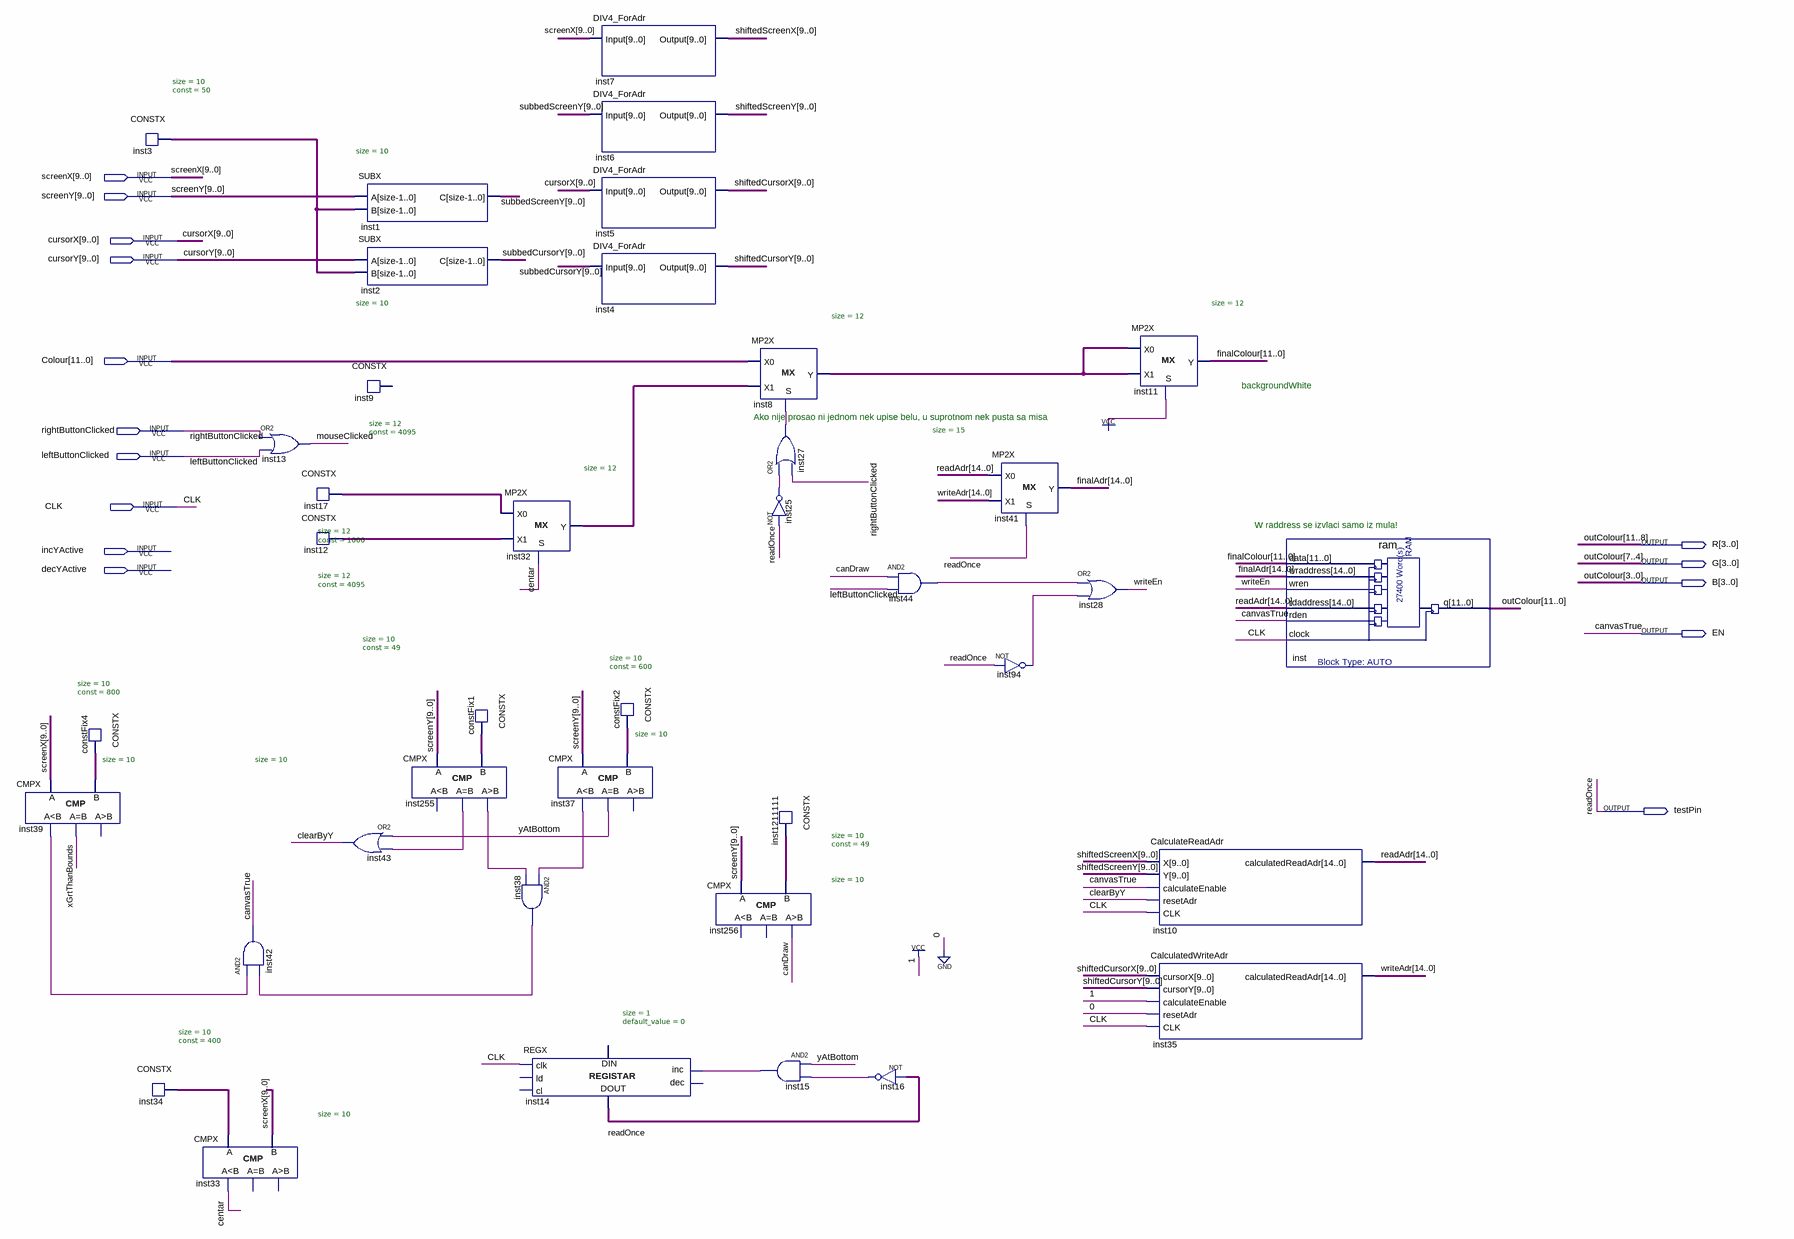
[diagram p0: schematic sheet]
// Quartus schematic Canvas.bdf as structural Verilog: 39 symbols, 15 pins
module Canvas (
  input  [9:0] screenX,
  input  [9:0] screenY,
  input  [9:0] cursorX,
  input  [9:0] cursorY,
  input  [11:0] Colour,
  input  rightButtonClicked,
  input  leftButtonClicked,
  input  CLK,
  input  incYActive,
  input  decYActive,
  output [3:0] R,
  output [3:0] G,
  output [3:0] B,
  output EN,
  output testPin
);

  wire canDraw, centar, clearByY, inst15_out, inst16_out, inst25_out, inst27_out, inst37_ls, inst38_out,
       inst39_ls, inst44_out, inst94_out, inst255_eq, inst255_gr, mouseClicked, writeEn, xGrtThanBounds,
       yAtBottom;
  wire [9:0] constFix1_data, constFix2_data, constFix4_data, inst3_data, inst34_data, inst1211111_data,
       shiftedCursorX, shiftedCursorY, shiftedScreenX, shiftedScreenY, subbedCursorY, subbedScreenY;
  wire [11:0] finalColour, inst8_y, inst12_data, inst17_data, inst32_y;
  wire [14:0] finalAdr, readAdr, writeAdr;

  CMPX #(.size(10)) inst39 (.A(screenX), .B(constFix4_data), .ls(inst39_ls), .eq(xGrtThanBounds));  // open: gr
  CONSTX #(.size(10), .\const (800)) constFix4 (.data(constFix4_data));
  CONSTX #(.size(10), .\const (50)) inst3 (.data(inst3_data));
  CONSTX #(.size(10), .\const (400)) inst34 (.data(inst34_data));
  CMPX #(.size(10)) inst33 (.A(inst34_data), .B(screenX), .ls(centar));  // open: eq, gr
  and inst42 (EN, inst39_ls, inst38_out);
  or inst13 (mouseClicked, rightButtonClicked, leftButtonClicked);
  CONSTX #(.size(12), .\const (1000)) inst17 (.data(inst17_data));
  CONSTX #(.size(12), .\const (4095)) inst12 (.data(inst12_data));
  SUBX #(.size(10)) inst1 (.A(screenY), .B(inst3_data), .C(subbedScreenY));
  SUBX #(.size(10)) inst2 (.A(cursorY), .B(inst3_data), .C(subbedCursorY));
  CONSTX #(.size(12), .\const (4095)) inst9 ();  // open: data
  or inst43 (clearByY, yAtBottom, inst255_eq);
  CMPX #(.size(10)) inst255 (.A(screenY), .B(constFix1_data), .eq(inst255_eq), .gr(inst255_gr));  // open: ls
  MP2X #(.size(12)) inst32 (.S(centar), .X0(inst17_data), .X1(inst12_data), .Y(inst32_y));
  CONSTX #(.size(10), .\const (49)) constFix1 (.data(constFix1_data));
  CMPX #(.size(10)) inst37 (.A(screenY), .B(constFix2_data), .ls(inst37_ls), .eq(yAtBottom));  // open: gr
  and inst38 (inst38_out, inst37_ls, inst255_gr);
  REGX #(.size(1), .default_value(0)) inst14 (
    .clk(CLK), .inc(inst15_out), .data_out(testPin));  // open: ld, cl, dec, data_in
  DIV4_ForAdr inst7 (.Input(screenX), .Output(shiftedScreenX));
  DIV4_ForAdr inst6 (.Input(subbedScreenY), .Output(shiftedScreenY));
  DIV4_ForAdr inst5 (.Input(cursorX), .Output(shiftedCursorX));
  DIV4_ForAdr inst4 (.Input(subbedCursorY), .Output(shiftedCursorY));
  CONSTX #(.size(10), .\const (600)) constFix2 (.data(constFix2_data));
  CMPX #(.size(10)) inst256 (.A(screenY), .B(inst1211111_data), .gr(canDraw));  // open: ls, eq
  MP2X #(.size(12)) inst8 (.S(inst27_out), .X0(Colour), .X1(inst32_y), .Y(inst8_y));
  and inst15 (inst15_out, yAtBottom, inst16_out);
  or inst27 (inst27_out, inst25_out, rightButtonClicked);
  not inst25 (inst25_out, testPin);
  CONSTX #(.size(10), .\const (49)) inst1211111 (.data(inst1211111_data));
  and inst44 (inst44_out, canDraw, leftButtonClicked);
  not inst16 (inst16_out, testPin);
  MP2X #(.size(15)) inst41 (.S(testPin), .X0(readAdr), .X1(writeAdr), .Y(finalAdr));
  not inst94 (inst94_out, testPin);
  or inst28 (writeEn, inst44_out, inst94_out);
  MP2X #(.size(12)) inst11 (.S(1'b1), .X0(inst8_y), .X1(inst8_y), .Y(finalColour));
  CalculateReadAdr inst10 (
    .X(shiftedScreenX), .Y(shiftedScreenY), .calculateEnable(EN), .resetAdr(clearByY), .CLK(CLK),
    .calculatedReadAdr(readAdr));
  CalculatedWriteAdr inst35 (
    .cursorX(shiftedCursorX), .cursorY(shiftedCursorY), .calculateEnable(1'b1), .resetAdr(1'b0), .CLK(CLK),
    .calculatedReadAdr(writeAdr));
  ram inst (
    .data(finalColour), .wraddress(finalAdr), .wren(writeEn), .rdaddress(readAdr), .rden(EN), .clock(CLK),
    .q({R, G, B}));

  // Other names for the same wires on the sheet: canvasTrue = EN; outColour[11:0] = {R, G, B}; readOnce = testPin

  // Notes on the sheet:
  //   backgroundWhite
  //   Ako nije prosao ni jednom nek upise belu, u suprotnom nek pusta sa misa
  //   W raddress se izvlaci samo iz mula!
endmodule
